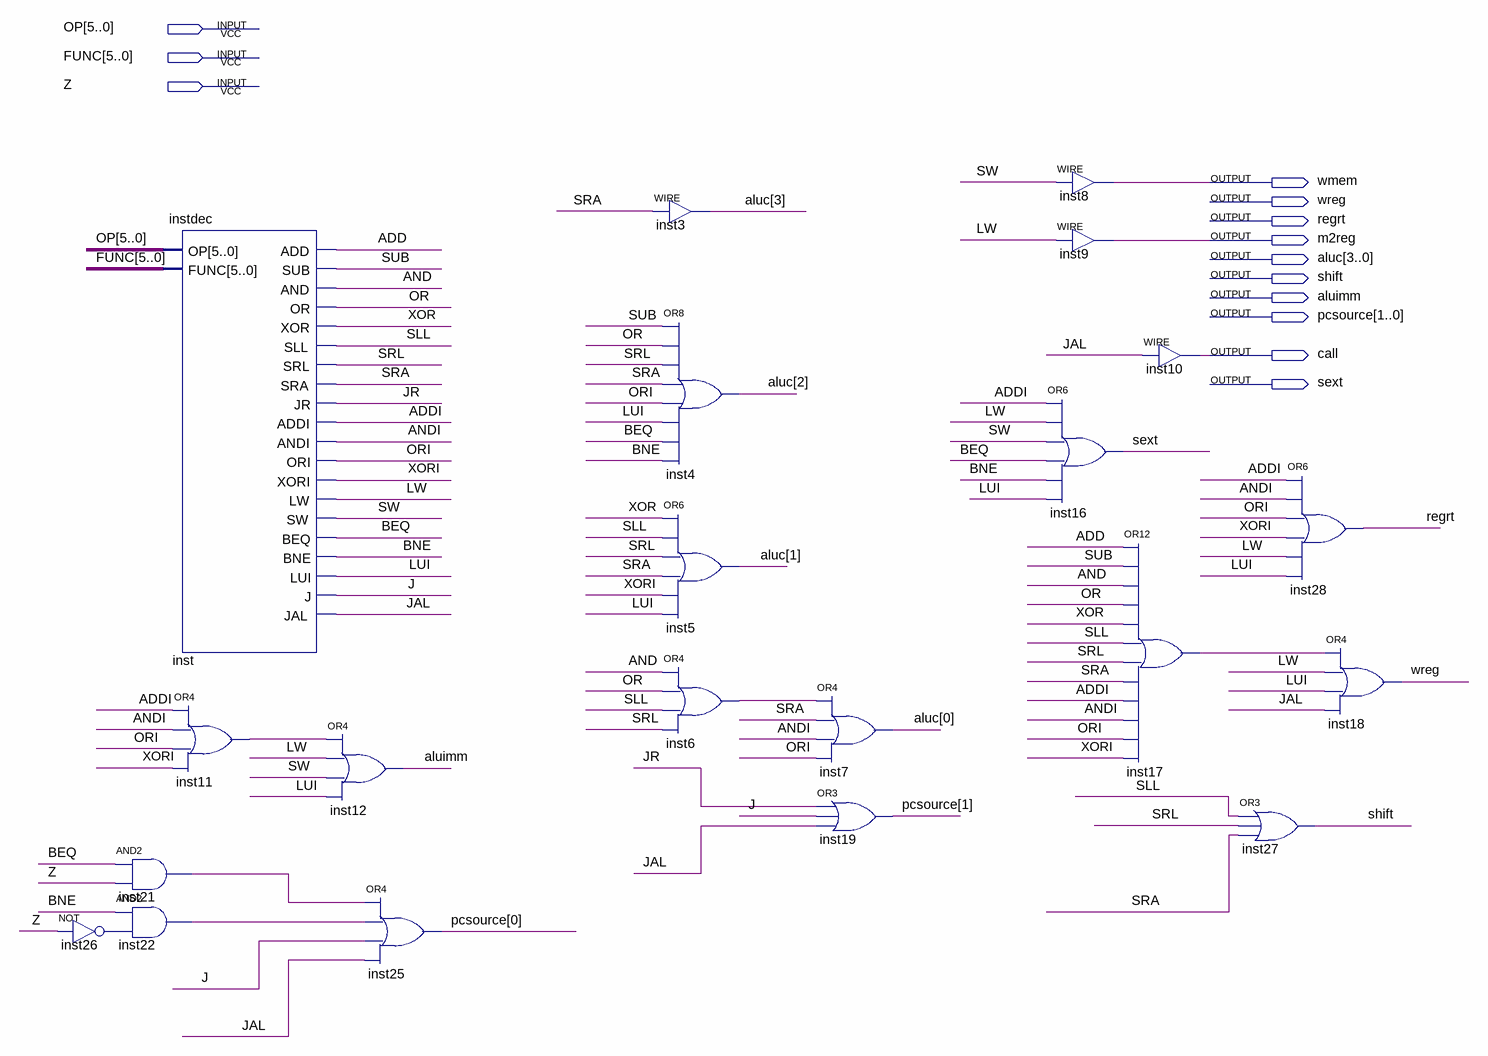
[diagram p0: schematic sheet]
// Quartus schematic Sc_cu.bdf as structural Verilog: 21 symbols, 13 pins
module Sc_cu (
  input  [5:0] OP,
  input  [5:0] FUNC,
  input  Z,
  output wmem,
  output wreg,
  output regrt,
  output m2reg,
  output [3:0] aluc,
  output shift,
  output aluimm,
  output [1:0] pcsource,
  output call,
  output sext
);

  wire ADD, ADDI, AND, ANDI, BEQ, BNE, inst6_out, inst11_out, inst17_out, inst21_out, inst22_out, inst26_out,
       J, JAL, JR, LUI, LW, OR, ORI, SLL, SRA, SRL, SUB, SW, XOR, XORI;

  not inst26 (inst26_out, Z);
  and inst21 (inst21_out, BEQ, Z);
  and inst22 (inst22_out, BNE, inst26_out);
  instdec inst (
    .OP(OP), .FUNC(FUNC), .ADD(ADD), .SUB(SUB), .AND(AND), .OR(OR), .XOR(XOR), .SLL(SLL), .SRL(SRL),
    .SRA(SRA), .JR(JR), .ADDI(ADDI), .ANDI(ANDI), .ORI(ORI), .XORI(XORI), .LW(LW), .SW(SW), .BEQ(BEQ),
    .BNE(BNE), .LUI(LUI), .J(J), .JAL(JAL));
  or inst11 (inst11_out, ADDI, ANDI, ORI, XORI);
  or inst12 (aluimm, inst11_out, LW, SW, LUI);
  or inst25 (pcsource[0], inst21_out, inst22_out, J, JAL);
  assign aluc[3] = SRA;  // WIRE inst3
  or inst4 (aluc[2], SUB, OR, SRL, SRA, ORI, LUI, BEQ, BNE);
  or inst5 (aluc[1], XOR, SLL, SRL, SRA, XORI, LUI);
  or inst6 (inst6_out, AND, OR, SLL, SRL);
  or inst7 (aluc[0], inst6_out, SRA, ANDI, ORI);
  or inst19 (pcsource[1], JR, J, JAL);
  assign wmem = SW;  // WIRE inst8
  assign m2reg = LW;  // WIRE inst9
  or inst16 (sext, ADDI, LW, SW, BEQ, BNE, LUI);
  assign call = JAL;  // WIRE inst10
  or inst17 (inst17_out, ADD, SUB, AND, OR, XOR, SLL, SRL, SRA, ADDI, ANDI, ORI, XORI);
  or inst28 (regrt, ADDI, ANDI, ORI, XORI, LW, LUI);
  or inst27 (shift, SLL, SRL, SRA);
  or inst18 (wreg, inst17_out, LW, LUI, JAL);
endmodule
